# EAGLE design MPU-9150-MS5611 (EAGLE 6.4)
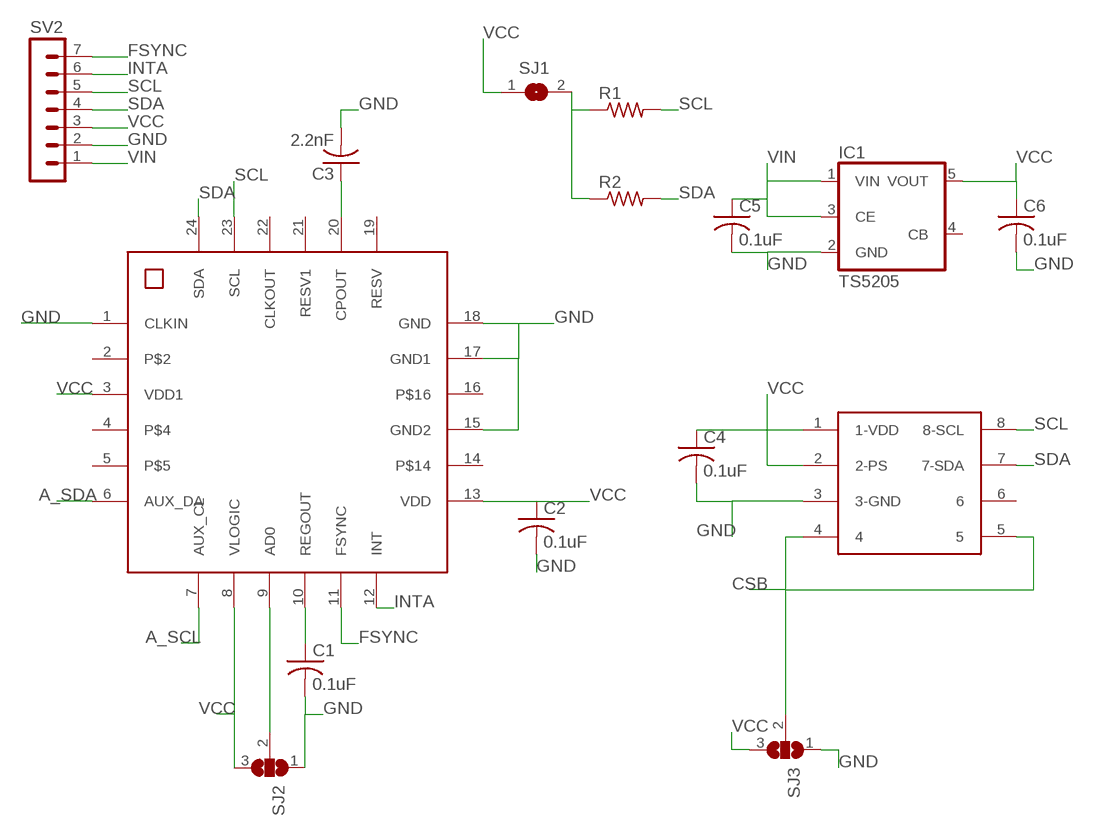
[diagram p0: schematic, sheet 1]

## Parts
C1  0.1uF  C-USC0603  [C0603]
C2  0.1uF  C-USC0603  [C0603]
C3  2.2nF  C-USC0603  [C0603]
C4  0.1uF  C-USC0603  [C0603]
C5  0.1uF  C-USC0603  [C0603]
C6  0.1uF  C-USC0603  [C0603]
IC1  TS5205  [SOT25]
MPU-9150  MPU-9150MPU-9150  [MPU-6050_QFN-24]
MS5611  MS5611  [MS5611-PACKAGE]
R1  R-US_R0603  [R0603]
R2  R-US_R0603  [R0603]
SJ1  SJ  [SJ]
SJ2  SJ2W  [SJ_2]
SJ3  SJ2W  [SJ_2]
SV2  MA07-1  [MA07-1]

## Nets
9: MPU-9150.9(AD0) SJ2.2
A_SCL: MPU-9150.7(AUX_CL)
A_SDA: MPU-9150.6(AUX_DA)
CSB: MS5611.4 MS5611.5 SJ3.2
FSYNC: MPU-9150.11(FSYNC) SV2.7
GND: C1.2 C2.2 C3.2 C4.2 C5.2 C6.2 IC1.2(GND) MPU-9150.1(CLKIN) MPU-9150.15(GND2) MPU-9150.17(GND1) MPU-9150.18(GND) MS5611.3(3-GND) SJ2.1 SJ3.1 SV2.2
INTA: MPU-9150.12(INT) SV2.6
N$1: C1.1 MPU-9150.10(REGOUT)
N$2: C3.1 MPU-9150.20(CPOUT)
PU: R1.1 R2.1 SJ1.2
SCL: MPU-9150.23(SCL) MS5611.8(8-SCL) R1.2 SV2.5
SDA: MPU-9150.24(SDA) MS5611.7(7-SDA) R2.2 SV2.4
VCC: C2.1 C4.1 C6.1 IC1.5(VOUT) MPU-9150.3(VDD1) MPU-9150.8(VLOGIC) MPU-9150.13(VDD) MS5611.1(1-VDD) MS5611.2(2-PS) SJ1.1 SJ2.3 SJ3.3 SV2.3
VIN: C5.1 IC1.1(VIN) IC1.3(CE) SV2.1
Unconnected: IC1.4(CB) MPU-9150.2 MPU-9150.4 MPU-9150.5 MPU-9150.14 MPU-9150.16 MPU-9150.19(RESV) MPU-9150.21(RESV1) MPU-9150.22(CLKOUT) MS5611.6

## Library data of the parts
C1-C6 = resistor:C-US: CAPACITOR, American symbol
IC1 = v-reg:TS5205: 150mA Low Noise LDO Voltage Regulator with Enable TSC [Taiwan Semiconductor Company, Ltd] Source: http://www.taiwansemi.com .. 5205_0409c.pdf
MPU-9150 = MPU-6050:MPU-9150
MS5611 = MS5611:MS5611
R1 R2 = resistor:R-US_: RESISTOR, American symbol
SJ1 = jumper:SJ: SMD solder JUMPER
SJ2 SJ3 = jumper:SJ2W: SMD solder JUMPER
SV2 = con-lstb:MA07-1: PIN HEADER; OC_FARNELL: unknown; OC_NEWARK: unknown

## Board
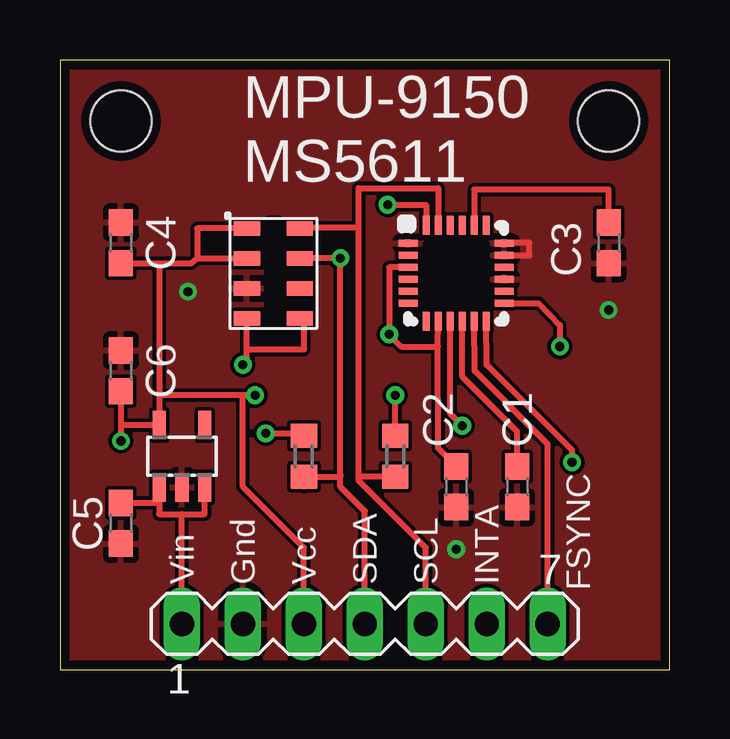
[diagram p1: board, top side]
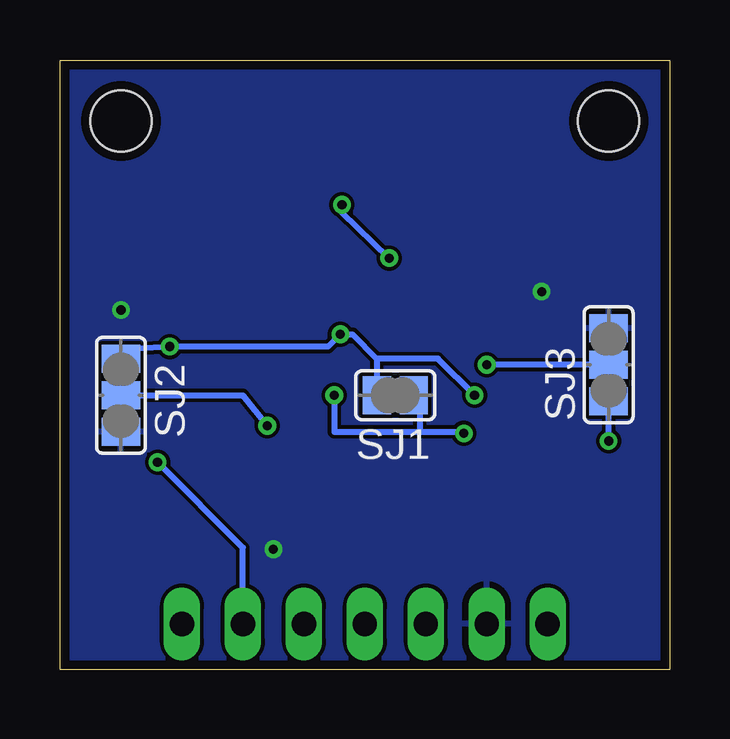
[diagram p2: board, bottom side, seen from below]

Size 25.4 x 25.4 mm. Coordinates in mm from the lower left corner, seen from the top.
Outline: 0,0 25.4,0 25.4,25.4 0,25.4 0,0
Copper layers (1*16): Top 0.0356mm / dielectric 1.5011mm / Bottom 0.0356mm
Design rules "LaenPCBOrder": minimum track width 6mil, minimum drill 13mil, track to track 6mil, track to pad 6mil, pad to pad 6mil, via to via 6mil, smd to smd 6mil, copper to edge 15mil, drill to drill 6mil, minimum pad ring 7mil, minimum via ring 7mil, stop-mask expansion 3mil, vias tented up to drill 0mil, thermal gap 10mil
Holes 2.54 mm at 2.54,22.86 22.86,22.86
tRestrict: area 8.6,14.5 to 9.1,18.8; area 15.2,15.2 to 17.8,17.8; 7 lines

### Footprints (pad centres in the part's own frame; a part is rotated, then mirrored left to right if it is on the bottom)
C0603 = smd 1.1 x 1: 1 -0.85,0; 2 0.85,0
SOT25 = smd 0.55 x 1.2: 1 -0.95,-1.3; 2 0,-1.3; 3 0.95,-1.3; 4 0.95,1.3; 5 -0.95,1.3
MPU-6050_QFN-24 = smd 0.8 x 0.3: 1 -2,1.25; 2 -2,0.75; 3 -2,0.25; 4 -2,-0.25; 5 -2,-0.75; 6 -2,-1.25; 13 2,-1.25; 14 2,-0.75; 15 2,-0.25; 16 2,0.25; 17 2,0.75; 18 2,1.25 | smd 0.3 x 0.8: 7 -1.25,-2; 8 -0.75,-2; 9 -0.25,-2; 10 0.25,-2; 11 0.75,-2; 12 1.25,-2; 19 1.25,2; 20 0.75,2; 21 0.25,2; 22 -0.25,2; 23 -0.75,2; 24 -1.25,2
MS5611-PACKAGE = smd 1.1 x 0.6: 1 -1.1,1.875; 2 -1.1,0.625; 3 -1.1,-0.625; 4 -1.1,-1.875; 5 1.1,-1.875; 6 1.1,-0.625; 7 1.1,0.625; 8 1.1,1.875
R0603 = smd 1 x 1.1: 1 -0.85,0; 2 0.85,0
SJ = smd 1.168 x 1.6: 1 -0.762,0; 2 0.762,0
SJ_2 = smd 1.168 x 1.6: 1 -1.524,0; 2 0,0; 3 1.524,0
MA07-1 = drill 1.016 long: 1 -7.62,0; 2 -5.08,0; 3 -2.54,0; 4 0,0; 5 2.54,0; 6 5.08,0; 7 7.62,0

### Placement (x,y rotation side)
C1  19.05,7.62 270 top
C2  16.51,7.62 270 top
C3  22.86,17.78 270 top
C4  2.54,17.78 90 top
C5  2.54,6.1 270 top
C6  2.54,12.45 90 top
IC1  5.08,8.89 0 top
MPU-9150  16.51,16.51 0 top
MS5611  8.89,16.51 0 top
R1  13.97,8.89 270 top
R2  10.16,8.89 270 top
SJ1  11.43,11.43 0 bottom
SJ2  22.86,11.43 90 bottom
SJ3  2.54,12.7 270 bottom
SV2  12.7,1.91 0 top

### Tracks (layer width: path | path; a pad name or v marks a point on that pad's centre or on a via)
9  (via drill 0.38)
  Top 0.254: v16.76,10.16 16.26,10.67 MPU-9150.9
  Bottom 0.254: SJ2.2 17.78,11.43 v16.76,10.16
CSB  (via drill 0.38)
  Top 0.254: v7.62,12.7 7.79,12.95 7.79,13.34 | 7.79,13.34 MS5611.4 | MS5611.5 10.16,14.63 10.16,13.34 7.79,13.34
  Bottom 0.254: SJ3.2 v7.62,12.7
FSYNC
  Top 0.254: SV2.7 20.32,9.4 17.27,12.45 MPU-9150.11
GND  (via drill 0.38)
  Top 0: MPU-9150.18 18.54,17.76 18.54,17.78
  Top 0.254: MPU-9150.17 19.56,17.26 19.56,17.78 18.54,17.78
  other vias: 16.51,5.02 5.33,15.75 22.86,14.99
  pour Bottom: 0,25.4 25.4,25.4 25.4,0 0,0
  pour Top: 0,25.4 25.4,25.4 25.4,0 0,0
INTA  (via drill 0.38)
  Top 0.254: v21.34,8.64 21.34,9.14 17.78,12.7 MPU-9150.12
  Bottom 0.254: SV2.6 17.78,5.08 v21.34,8.64
N$1
  Top 0.254: C1.1 19.05,9.91 16.76,12.19 MPU-9150.10
N$2
  Top 0.254: C3.1 22.86,20 17.26,20 MPU-9150.20
N$3
  Bottom 0.254: 2.54,13.97 2.54,12.95
N$4
  Bottom 0.254: 10.92,11.43 11.94,11.43
N$5
  Bottom 0.254: 22.86,11.18 22.86,10.16
PU  (via drill 0.38)
  Top 0.254: v8.57,9.84 10.16,9.84 R2.1 | R1.1 v13.97,11.43
  Bottom 0.254: SJ1.2 10.41,11.43 10.41,9.91 | 10.41,9.91 8.64,9.91 v8.57,9.84 | v13.97,11.43 13.97,9.91 10.41,9.91
SCL
  Top 0.254: SV2.5 15.24,5.08 12.45,7.87 12.45,8.04 | 12.45,8.04 12.45,18.41 | 12.45,18.41 9.99,18.41 MS5611.8 | 12.45,18.41 12.45,20.07 15.76,20.07 MPU-9150.23 | R1.2 12.45,8.04
SDA  (via drill 0.38)
  Top 0.254: SV2.4 12.7,6.6 11.68,7.62 11.68,8.04 | 10.16,7.62 R2.2 11.68,8.04 | MS5611.7 v11.68,17.14 11.68,8.13 11.68,8.04 | v13.65,19.37 15.26,19.37 MPU-9150.24
  Bottom 0.254: v11.68,17.14 13.65,19.05 v13.65,19.37
VCC  (via drill 0.38)
  Top 0.254: 2.54,10.19 IC1.5 4.13,11.43 | 2.54,10.19 v2.54,9.53 | C4.1 4.13,16.93 | 4.13,16.93 4.13,16.83 4.13,11.43 | 4.13,16.93 5.46,16.93 5.71,17.14 | 5.71,17.14 MS5611.2 | MS5611.1 5.71,18.39 5.71,17.14 | MPU-9150.3 13.72,16.76 v13.72,13.97 14.22,13.46 15.75,13.46 | SV2.3 10.16,5.08 7.62,7.62 7.62,11.43 v8.13,11.43 4.13,11.43 | C2.1 15.76,9.23 15.75,13.46 | 15.75,13.46 MPU-9150.8 | MPU-9150.13 19.94,15.26 20.83,14.35 v20.83,13.46 | C6.1 2.54,10.19
  Bottom 0.254: v2.54,9.53 SJ3.3 | 12.19,12.95 13.21,13.97 v13.72,13.97 14.22,13.46 v20.83,13.46 22.86,13.34 SJ2.3 | 12.19,12.95 SJ1.1 | v8.13,11.43 9.65,12.95 12.19,12.95
VIN
  Top 0.254: SV2.1 5.08,6.48 | 5.08,6.48 6.03,6.48 IC1.3 | IC1.1 4.13,6.95 | 4.13,6.95 4.13,6.48 5.08,6.48 | C5.1 4.13,6.95

### Text on the board
tNames: MPU-9150 / MS5611 | Vin | Gnd | Vcc | SDA | SCL | INTA | FSYNC